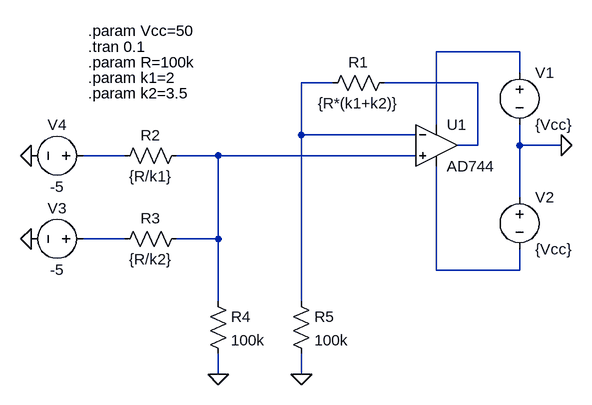
[diagram p0: schematic Draft9.asc]
Draft9.asc, the LTspice schematic file:
Version 4.1
SHEET 1 880 680
WIRE 320 32 192 32
WIRE 320 64 320 32
WIRE 32 80 -16 80
WIRE 256 80 112 80
WIRE 192 144 192 32
WIRE -16 160 -16 80
WIRE 160 160 -16 160
WIRE 256 176 256 80
WIRE 256 176 224 176
WIRE 320 176 320 144
WIRE 384 176 320 176
WIRE -288 192 -352 192
WIRE -144 192 -208 192
WIRE 160 192 -144 192
WIRE 320 256 320 176
WIRE -288 320 -352 320
WIRE -144 320 -144 192
WIRE -144 320 -208 320
WIRE 192 368 192 208
WIRE 320 368 320 336
WIRE 320 368 192 368
WIRE -144 416 -144 320
WIRE -16 416 -16 160
WIRE -144 528 -144 496
WIRE -16 528 -16 496
FLAG 384 176 0
FLAG -16 528 0
FLAG -144 528 0
FLAG -432 192 0
FLAG -432 320 0
SYMBOL OpAmps\\AD744 192 112 R0
SYMATTR InstName U1
SYMBOL voltage 320 48 R0
SYMATTR InstName V1
SYMATTR Value {Vcc}
SYMBOL voltage 320 240 R0
SYMATTR InstName V2
SYMATTR Value {Vcc}
SYMBOL res 128 64 R90
WINDOW 0 0 56 VBottom 2
WINDOW 3 32 56 VTop 2
SYMATTR InstName R1
SYMATTR Value {R*(k1+k2)}
SYMBOL res -192 176 R90
WINDOW 0 0 56 VBottom 2
WINDOW 3 32 56 VTop 2
SYMATTR InstName R2
SYMATTR Value {R/k1}
SYMBOL res -192 304 R90
WINDOW 0 0 56 VBottom 2
WINDOW 3 32 56 VTop 2
SYMATTR InstName R3
SYMATTR Value {R/k2}
SYMBOL res -160 400 R0
SYMATTR InstName R4
SYMATTR Value 100k
SYMBOL res -32 400 R0
SYMATTR InstName R5
SYMATTR Value 100k
SYMBOL voltage -336 320 R90
WINDOW 0 -32 56 VBottom 2
WINDOW 3 32 56 VTop 2
SYMATTR InstName V3
SYMATTR Value -5
SYMBOL voltage -336 192 R90
WINDOW 0 -32 56 VBottom 2
WINDOW 3 32 56 VTop 2
SYMATTR InstName V4
SYMATTR Value -5
TEXT -344 0 Left 2 !.param Vcc=50
TEXT -344 24 Left 2 !.tran 0.1
TEXT -344 48 Left 2 !.param R=100k
TEXT -344 72 Left 2 !.param k1=2
TEXT -344 96 Left 2 !.param k2=3.5

The netlist it stands for:
* Draft9.asc
X§U1 N005 N002 N001 N007 N003 AD744  ; pins In+ In- V+ V- OUT
V1 N001 0 {Vcc}
V2 0 N007 {Vcc}
R1 N003 N002 {R*(k1+k2)}
R2 N005 N004 {R/k1}
R3 N005 N006 {R/k2}
R4 N005 0 100k
R5 N002 0 100k
V3 N006 0 -5
V4 N004 0 -5
.param Vcc=50
.tran 0.1
.param R=100k
.param k1=2
.param k2=3.5
.backanno
.end